# Altium project RiskChemi_Monitor_V1.04M1.PrjPcb
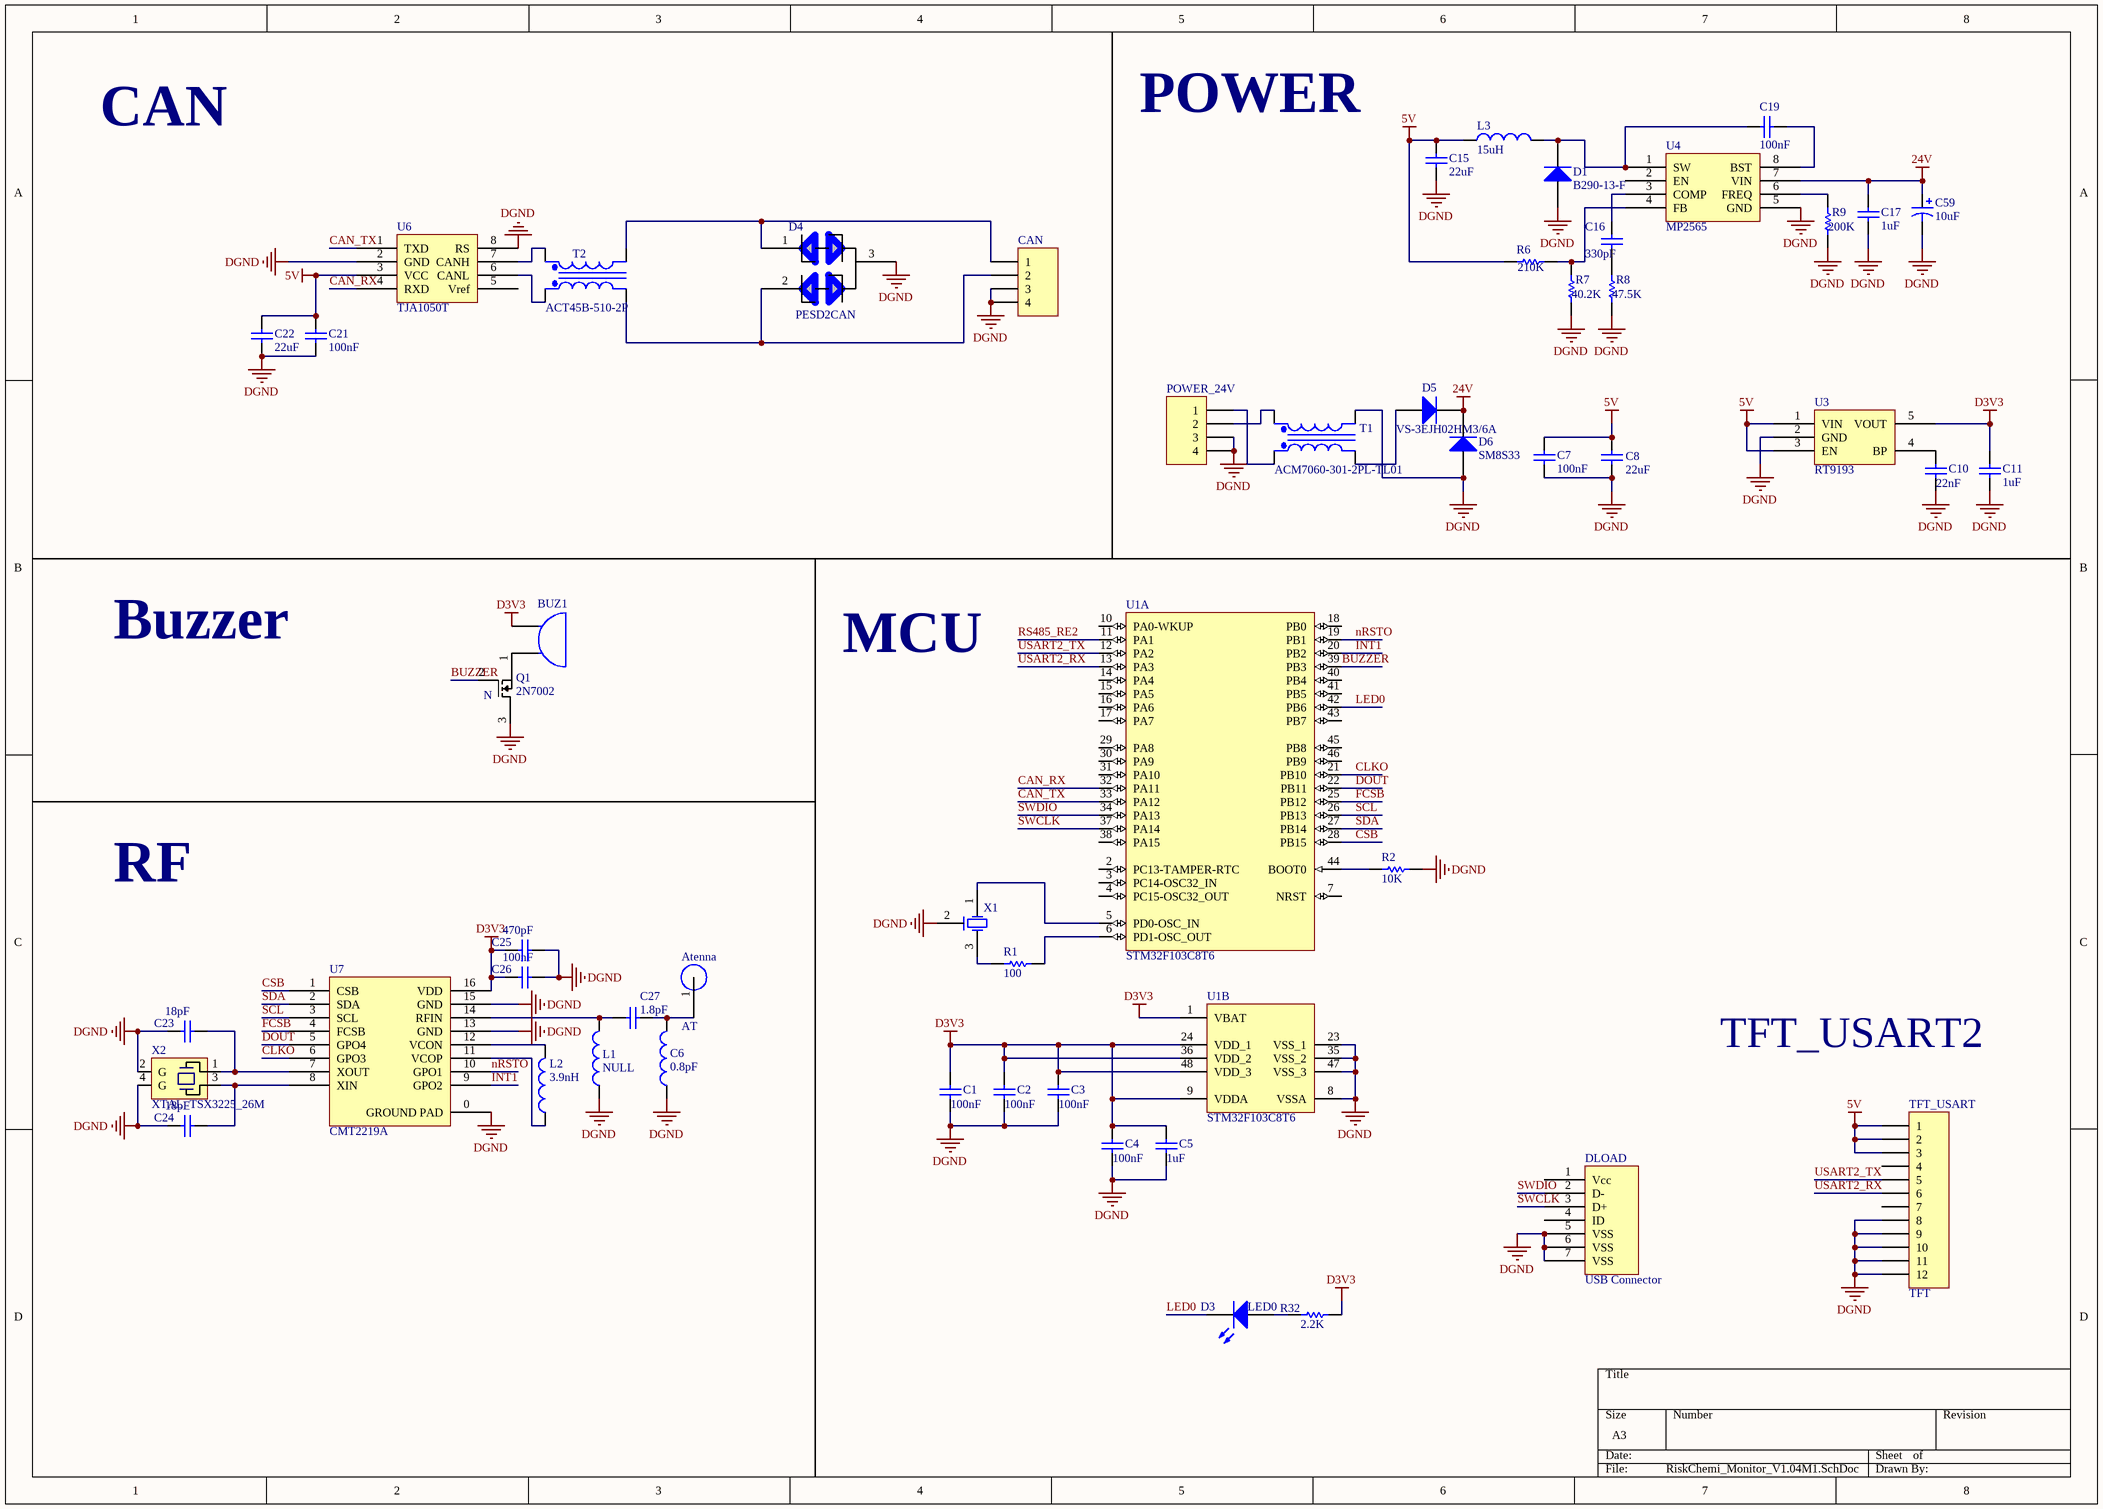
[diagram p0: RiskChemi_Monitor_V1.04M1.SchDoc]
1 sheet, 53 parts. Net scope: global (net labels, ports and power ports of the same name join across sheets).
Board file: RiskChemi_Monitor_V1.04M1.PcbDoc

## Sheet RiskChemi_Monitor_V1.04M1.SchDoc
size A3

### Parts
Atenna  AT  [433MHz Atenna]
BUZ1  BUZZER  [BUZ0905]  (value not drawn)
C1  100nF  [0603]
C2  100nF  [0603]
C3  100nF  [0603]
C4  100nF  [0603]
C5  1uF  [0603]
C6  0.8pF  [0402]
C7  100nF  [0805]
C8  22uF  [0805]
C10  22nF  [0603]
C11  1uF  [0603]
C15  22uF  [0805]
C16  330pF  [0402]
C17  1uF  [0805]
C19  100nF  [0402]
C21  100nF  [0603]
C22  22uF  [0805]
C23  18pF  [0402]
C24  18pF  [0402]
C25  470pF  [0402]
C26  100nF  [0603]
C27  1.8pF  [nosilk_0402]
C59  10uF  [6032_pol]
CAN  Header 4  [C3000VS]  (value not drawn)
D1  B290-13-F  [B290]
D3  LED0  [LED]
D4  PESD2CAN  [SOT23]
D5  VS-3EJH02HM3/6A  [B290]
D6  SM8S33  [SM8S]
DLOAD  USB Connector  [Mini_USB]
L1  NULL  [0402]
L2  3.9nH  [0603]
L3  15uH  [4*4 Inductor]
POWER_24V  Header 4  [C3000VS]  (value not drawn)
Q1  2N7002  [2N7002]
R1  100  [0603]
R2  10K  [0603]
R6  210K  [0402]
R7  40.2K  [0402]
R8  47.5K  [0402]
R9  200K  [0402]
R32  2.2K  [0603]
T1  ACM7060-301-2PL-TL01  [ACM7060-301-2P-TL01]
T2  ACT45B-510-2P  [ACT45B-510-2P]
TFT_USART  TFT  [FCC_10pin_1mm]
U1  STM32F103C8T6  [STM-LQFP48_N]  (parts A,B of 2)
U3  RT9193  [SOT-23-5]
U4  MP2565  [SO8]
U6  TJA1050T  [SO8]
U7  CMT2219A  [QFN16]
X1  8M smd  [8Mhz_XTAL]  (value not drawn)
X2  XTAL_TSX3225_26M  [XTAL3225]

### Nets
5V: C7.2 C8.2 C15.2 C21.1 C22.2 L3.1 R6.2 TFT_USART.1 TFT_USART.2 TFT_USART.3 U3.1(VIN) U3.3(EN) U6.3(VCC)
24V: C17.2 C59.1 D5.2(K) D6.2(K) U4.7(VIN)
D3V3: BUZ1.1(A) C1.2 C2.2 C3.2 C4.2 C5.2 C11.2 C25.2 C26.2 R32.1 U1.1(VBAT) U1.9(VDDA) U1.24(VDD_1) U1.36(VDD_2) U1.48(VDD_3) U3.5(VOUT) U7.16(VDD)
DGND: C1.1 C2.1 C3.1 C4.1 C5.1 C6.1 C7.1 C8.1 C10.1 C11.1 C15.1 C17.1 C21.2 C22.1 C23.2 C24.2 C25.1 C26.1 C59.2 CAN.3 CAN.4 D1.1(A) D4.3 D6.1(A) DLOAD.5(VSS) DLOAD.6(VSS) DLOAD.7(VSS) L1.1 POWER_24V.3 POWER_24V.4 Q1.3(S) R2.2 R7.1 R8.1 R9.1 T1.4(Sec-) TFT_USART.8 TFT_USART.9 TFT_USART.10 TFT_USART.11 TFT_USART.12 U1.8(VSSA) U1.23(VSS_1) U1.35(VSS_2) U1.47(VSS_3) U3.2(GND) U4.5(GND) U6.2(GND) U6.8(RS) U7.0(GROUND_PAD) U7.13(GND) U7.15(GND) X1.2(GND) X2.2(G) X2.4(G)
BUZZER: Q1.2(G) U1.39(PB3)
CAN_RX: U1.32(PA11) U6.4(RXD)
CAN_TX: U1.33(PA12) U6.1(TXD)
CLKO: U1.21(PB10) U7.6(GPO3)
CSB: U1.28(PB15) U7.1(CSB)
DOUT: U1.22(PB11) U7.5(GPO4)
FCSB: U1.25(PB12) U7.4(FCSB)
INT1: U1.20(PB2) U7.9(GPO2)
LED0: D3.2(K) U1.42(PB6)
nRSTO: U1.19(PB1) U7.10(GPO1)
RS485_RE2: U1.11(PA1)
SCL: U1.26(PB13) U7.3(SCL)
SDA: U1.27(PB14) U7.2(SDA)
SWCLK: DLOAD.3(D+) U1.37(PA14)
SWDIO: DLOAD.2(D-) U1.34(PA13)
USART2_RX: TFT_USART.6 U1.13(PA3)
USART2_TX: TFT_USART.5 U1.12(PA2)
NetAtenna_1: Atenna.1 C6.2 C27.1
NetBUZ1_2: BUZ1.2(B) Q1.1(D)
NetC10_2: C10.2 U3.4(BP)
NetC16_1: C16.1 U4.3(COMP)
NetC16_2: C16.2 R8.2
NetC19_1: C19.1 U4.8(BST)
NetC19_2: C19.2 D1.2(K) L3.2 U4.1(SW)
NetC23_1: C23.1 U7.7(XOUT) X2.1
NetC24_1: C24.1 U7.8(XIN) X2.3
NetC27_2: C27.2 L1.2 U7.14(RFIN)
NetCAN_1: CAN.1 D4.1 T2.4(Sec-)
NetCAN_2: CAN.2 D4.2 T2.2(Pri-)
NetD3_1: D3.1(A) R32.2
NetD5_1: D5.1(A) T1.2(Pri-)
NetL2_1: L2.1 U7.11(VCOP)
NetL2_2: L2.2 U7.12(VCON)
NetPOWER_24V_1: POWER_24V.1 T1.1(Pri+)
NetPOWER_24V_2: POWER_24V.2 T1.3(Sec+)
NetR1_1: R1.1 X1.3(OSC2)
NetR1_2: R1.2 U1.6(PD1-OSC_OUT)
NetR2_1: R2.1 U1.44(BOOT0)
NetR6_1: R6.1 R7.2 U4.4(FB)
NetR9_2: R9.2 U4.6(FREQ)
NetT2_1: T2.1(Pri+) U6.6(CANL)
NetT2_3: T2.3(Sec+) U6.7(CANH)
NetU1_5: U1.5(PD0-OSC_IN) X1.1(OSC1)

Not connected (* = marked no-connect by the designer): DLOAD 1(Vcc) 4(ID); TFT_USART 4 7; U1 2(PC13-TAMPER-RTC) 3(PC14-OSC32_IN) 4(PC15-OSC32_OUT) 7(NRST) 10(PA0-WKUP) 14(PA4) 15(PA5) 16(PA6) 17(PA7) 18(PB0) 29(PA8) 30(PA9) 31(PA10) 38(PA15) 40(PB4) 41(PB5) 43(PB7) 45(PB8) 46(PB9); U4 2(EN); U6 5(Vref)

### Notes on the sheet
- CAN
- POWER
- Buzzer
- MCU
- RF
- TFT_USART2
- (in symbol N-MOSFET) N

### Library data of the parts
C1-C5 C8 C10 C11 C16 C19 C21-C26 = Cap: Capacitor; Published: 8-Jun-2000; Publisher: Altium Limited
  C1-C4 C19 C21 C26: LatestRevisionDate: 17-Jul-2002; LatestRevisionNote: Re-released for DXP Platform.; PackageReference: RAD-0.3; PackageDescription: Radial Cap, Thru-Hole; 2 Leads; 0.3 in Pin Spacing; Value: 100nF
  C5 C11: LatestRevisionDate: 17-Jul-2002; LatestRevisionNote: Re-released for DXP Platform.; PackageReference: RAD-0.3; PackageDescription: Radial Cap, Thru-Hole; 2 Leads; 0.3 in Pin Spacing; Value: 1uF
  C8: LatestRevisionDate: 17-Jul-2002; LatestRevisionNote: Re-released for DXP Platform.; PackageReference: RAD-0.3; PackageDescription: Radial Cap, Thru-Hole; 2 Leads; 0.3 in Pin Spacing; Value: 22uF
  C10: LatestRevisionDate: 17-Jul-2002; LatestRevisionNote: Re-released for DXP Platform.; PackageReference: RAD-0.3; PackageDescription: Radial Cap, Thru-Hole; 2 Leads; 0.3 in Pin Spacing; Value: 22nF
  C16: LatestRevisionDate: 17-Jul-2002; LatestRevisionNote: Re-released for DXP Platform.; PackageReference: RAD-0.3; PackageDescription: Radial Cap, Thru-Hole; 2 Leads; 0.3 in Pin Spacing; Value: 330pF
  C22: Revision: July-2002: Re-released for DXP Platform.; Value: 22uF
  C23 C24: LatestRevisionDate: 17-Jul-2002; LatestRevisionNote: Re-released for DXP Platform.; PackageReference: RAD-0.3; PackageDescription: Radial Cap, Thru-Hole; 2 Leads; 0.3 in Pin Spacing; Value: 18pF
  C25: LatestRevisionDate: 17-Jul-2002; LatestRevisionNote: Re-released for DXP Platform.; PackageReference: RAD-0.3; PackageDescription: Radial Cap, Thru-Hole; 2 Leads; 0.3 in Pin Spacing; Value: 470pF
C6 L1 = Inductor: Code_IEC: 1005; Value: 6.8nH; Published: 8-Jun-2000; LatestRevisionDate: 29-May-2009; LatestRevisionNote: IPC-7351 Footprint Added.; PackageReference: 0402-A; Publisher: Altium Limited; PackageDescription: Chip Inductor; Code_JEITA: 0402
C7 C17 = Cap: Capacitor,100V; Published: 8-Jun-2000; LatestRevisionDate: 17-Jul-2002; LatestRevisionNote: Re-released for DXP Platform.; PackageReference: RAD-0.3; Publisher: Altium Limited; PackageDescription: Radial Cap, Thru-Hole; 2 Leads; 0.3 in Pin Spacing
  C7: Value: 100nF
  C17: Value: 1uF
C15 = Cap: Capacitor,50V; Published: 8-Jun-2000; LatestRevisionDate: 17-Jul-2002; LatestRevisionNote: Re-released for DXP Platform.; PackageReference: RAD-0.3; Publisher: Altium Limited; PackageDescription: Radial Cap, Thru-Hole; 2 Leads; 0.3 in Pin Spacing; Value: 22uF
C27 = Cap: Capacitor; Value: 2.7pF; Published: 8-Jun-2000; LatestRevisionDate: 17-Jul-2002; LatestRevisionNote: Re-released for DXP Platform.; PackageReference: RAD-0.3; Publisher: Altium Limited; PackageDescription: Radial Cap, Thru-Hole; 2 Leads; 0.3 in Pin Spacing
C59 = Cap Pol1: Polarized Capacitor (Radial); Published: 8-Jun-2000; LatestRevisionDate: 17-Jul-2002; LatestRevisionNote: Re-released for DXP Platform.; PackageReference: RB7.6-15; Publisher: Altium Limited; PackageDescription: Polarized Capacitor (Radial); 2 Leads; Value: 10uF
CAN POWER_24V = Header 4: Header, 4-Pin; LatestRevisionDate: 17-Jul-2002; LatestRevisionNote: Re-released for DXP Platform.; Publisher: Altium Limited
D1 = Diode: Default Diode; Published: 8-Jun-2000; LatestRevisionDate: 17-Jul-2002; LatestRevisionNote: Re-released for DXP Platform.; PackageVersion: Sep-1996; PackageReference: SMC; Publisher: Altium Limited; PackageDescription: DO-214-AB/SMC; 2 C-Bend Leads; Body 7.9 x 5.9 mm, inc. leads (LxW); Code_JEDEC: DO-214-AB
D3 = LED0: green LED; Published: 8-Jun-2000; LatestRevisionDate: 08-Jul-2005; LatestRevisionNote: Mech Layer 1 removed.; PackageReference: LED-0; Publisher: Altium Limited; PackageDescription: LED; 2 Leads
D4 = PESD1CAN
D5 = Diode 1N4007: 1 Amp General Purpose Rectifier; pin to pad: 1>2 2>1; Published: 8-Jun-2000; LatestRevisionDate: 17-Jul-2002; LatestRevisionNote: Re-released for DXP Platform.; DatasheetVersion: 1998; PackageVersion: Aug-1999; PackageReference: DO-41; Publisher: Altium Limited; PackageDescription: Diode, Axial; Body 5.2 x 2.7 mm (LxDia. max), Lead Dia. 0.86 mm (max); Code_JEDEC: DO-204-AL; ComponentLink1Description: Manufacturer Link; ComponentLink1URL: http://www.fairchildsemi.com/; ComponentLink2Description: Datasheet; ComponentLink2URL: http://www.fairchildsemi.com/ds/1N%2F1N4001.pdf
D6 = Diode 1N4007: 1 Amp General Purpose Rectifier; Published: 8-Jun-2000; LatestRevisionDate: 17-Jul-2002; LatestRevisionNote: Re-released for DXP Platform.; DatasheetVersion: 1998; PackageVersion: Aug-1999; PackageReference: DO-41; Publisher: Altium Limited; PackageDescription: Diode, Axial; Body 5.2 x 2.7 mm (LxDia. max), Lead Dia. 0.86 mm (max); Code_JEDEC: DO-204-AL; ComponentLink1Description: Manufacturer Link; ComponentLink1URL: http://www.fairchildsemi.com/; ComponentLink2Description: Datasheet; ComponentLink2URL: http://www.fairchildsemi.com/ds/1N%2F1N4001.pdf
DLOAD = Component_1
L2 = Inductor: Code_IEC: 1005; Published: 8-Jun-2000; LatestRevisionDate: 29-May-2009; LatestRevisionNote: IPC-7351 Footprint Added.; PackageReference: 0402-A; Publisher: Altium Limited; PackageDescription: Chip Inductor; Code_JEITA: 0402; Value: 3.9nH
L3 = Inductor: Inductor, 1A; Code_IEC: 1005; Published: 8-Jun-2000; LatestRevisionDate: 29-May-2009; LatestRevisionNote: IPC-7351 Footprint Added.; PackageReference: 0402-A; Publisher: Altium Limited; PackageDescription: Chip Inductor; Code_JEITA: 0402; Value: 15uH
Q1 = N-MOSFET
R1 R2 R6-R9 R32 = Res1: Resistor; Published: 8-Jun-2000; LatestRevisionDate: 17-Jul-2002; LatestRevisionNote: Re-released for DXP Platform.; PackageReference: AXIAL-0.3; Publisher: Altium Limited
  R1: PackageDescription: Axial Device, Thru-Hole; 2 Leads; 0.3 in Pin Spacing; Value: 100
  R2: PackageDescription: Axial Device, Thru-Hole; 2 Leads; 0.3 in Pin Spacing; Value: 10K
  R6: Value: 210K
  R7: Value: 40.2K
  R8: Value: 47.5K
  R9: Value: 200K
  R32: Value: 2.2K
T1 T2 = Trans Eq: Transformer (Equivalent Circuit Model); Published: 8-Jun-2000; LatestRevisionDate: 17-Jul-2002; LatestRevisionNote: Re-released for DXP Platform.; PackageReference: TRF_4; Publisher: Altium Limited; PackageDescription: Transformer; 4 Leads
TFT_USART = Header 12: Header, 12-Pin; LatestRevisionDate: 17-Jul-2002; LatestRevisionNote: Re-released for DXP Platform.; Publisher: Altium Limited
U1 = STM32F103C8T6: ARM Cortex-M3 32-bit MCU, 64 KB Flash, 20 KB Internal RAM, 37 I/Os, 48-pin LQFP, -40 to 85 degC, Tray; A/D Converter: 2x12-bit (10 Channel); FLASH Size (Prog) (kB): 64; I/Os (High Current): 37; Internal RAM Size (kB): 20; Operating Frequency(F) (Processor speed) (MHz): 72; Supply Voltage(Vcc) min (V): 2; DatasheetVersion: Rev. 16; PackageVersion: Rev. 6, 06/2013; PackageReference: LQFP48; PackageDescription: 48-Pin Low Profile Quad Flat Package, 7 x 7 mm Body, 0.5 mm Pitch; Supplier 1: Digi-Key; Supplier Part Number 1: 497-6063-ND; Supplier 2: Farnell; Supplier Part Number 2: 1447637; Supplier 3: Newark; Supplier Part Number 3: 59M2182; Supplier 4: Newark; Supplier Part Number 4: 57P1222; Supplier 5: Mouser; Supplier Part Number 5: 511-STM32F103C8T6; Core: ARM Cortex-M3; Packing: Tray; Mounting Technology: Surface Mount; PartNumber: STM32F103C8T6; ComponentLink1Description: Manufacturer URL; ComponentLink1URL: http://www.st.com/web/en/home.html; ComponentLink2Description: Datasheet; ComponentLink2URL: http://www.st.com/st-web-ui/static/active/en/resource/technical/document/datasheet/CD00161566.pdf; ComponentLink3Description: Package Specification; ComponentLink3URL: http://www.st.com/st-web-ui/static/active/en/resource/technical/document/datasheet/DM00058181.pdf
U4 = MP1584: DCDC 4.5V~28V input 1.8V ~5V output low power; Manufacture: MPS
U6 = TJA1050T: CAN Tranceiver
X2 = XTAL_Negative